# Altium schematic sheet STM32L071CZ.SchDoc
size A3
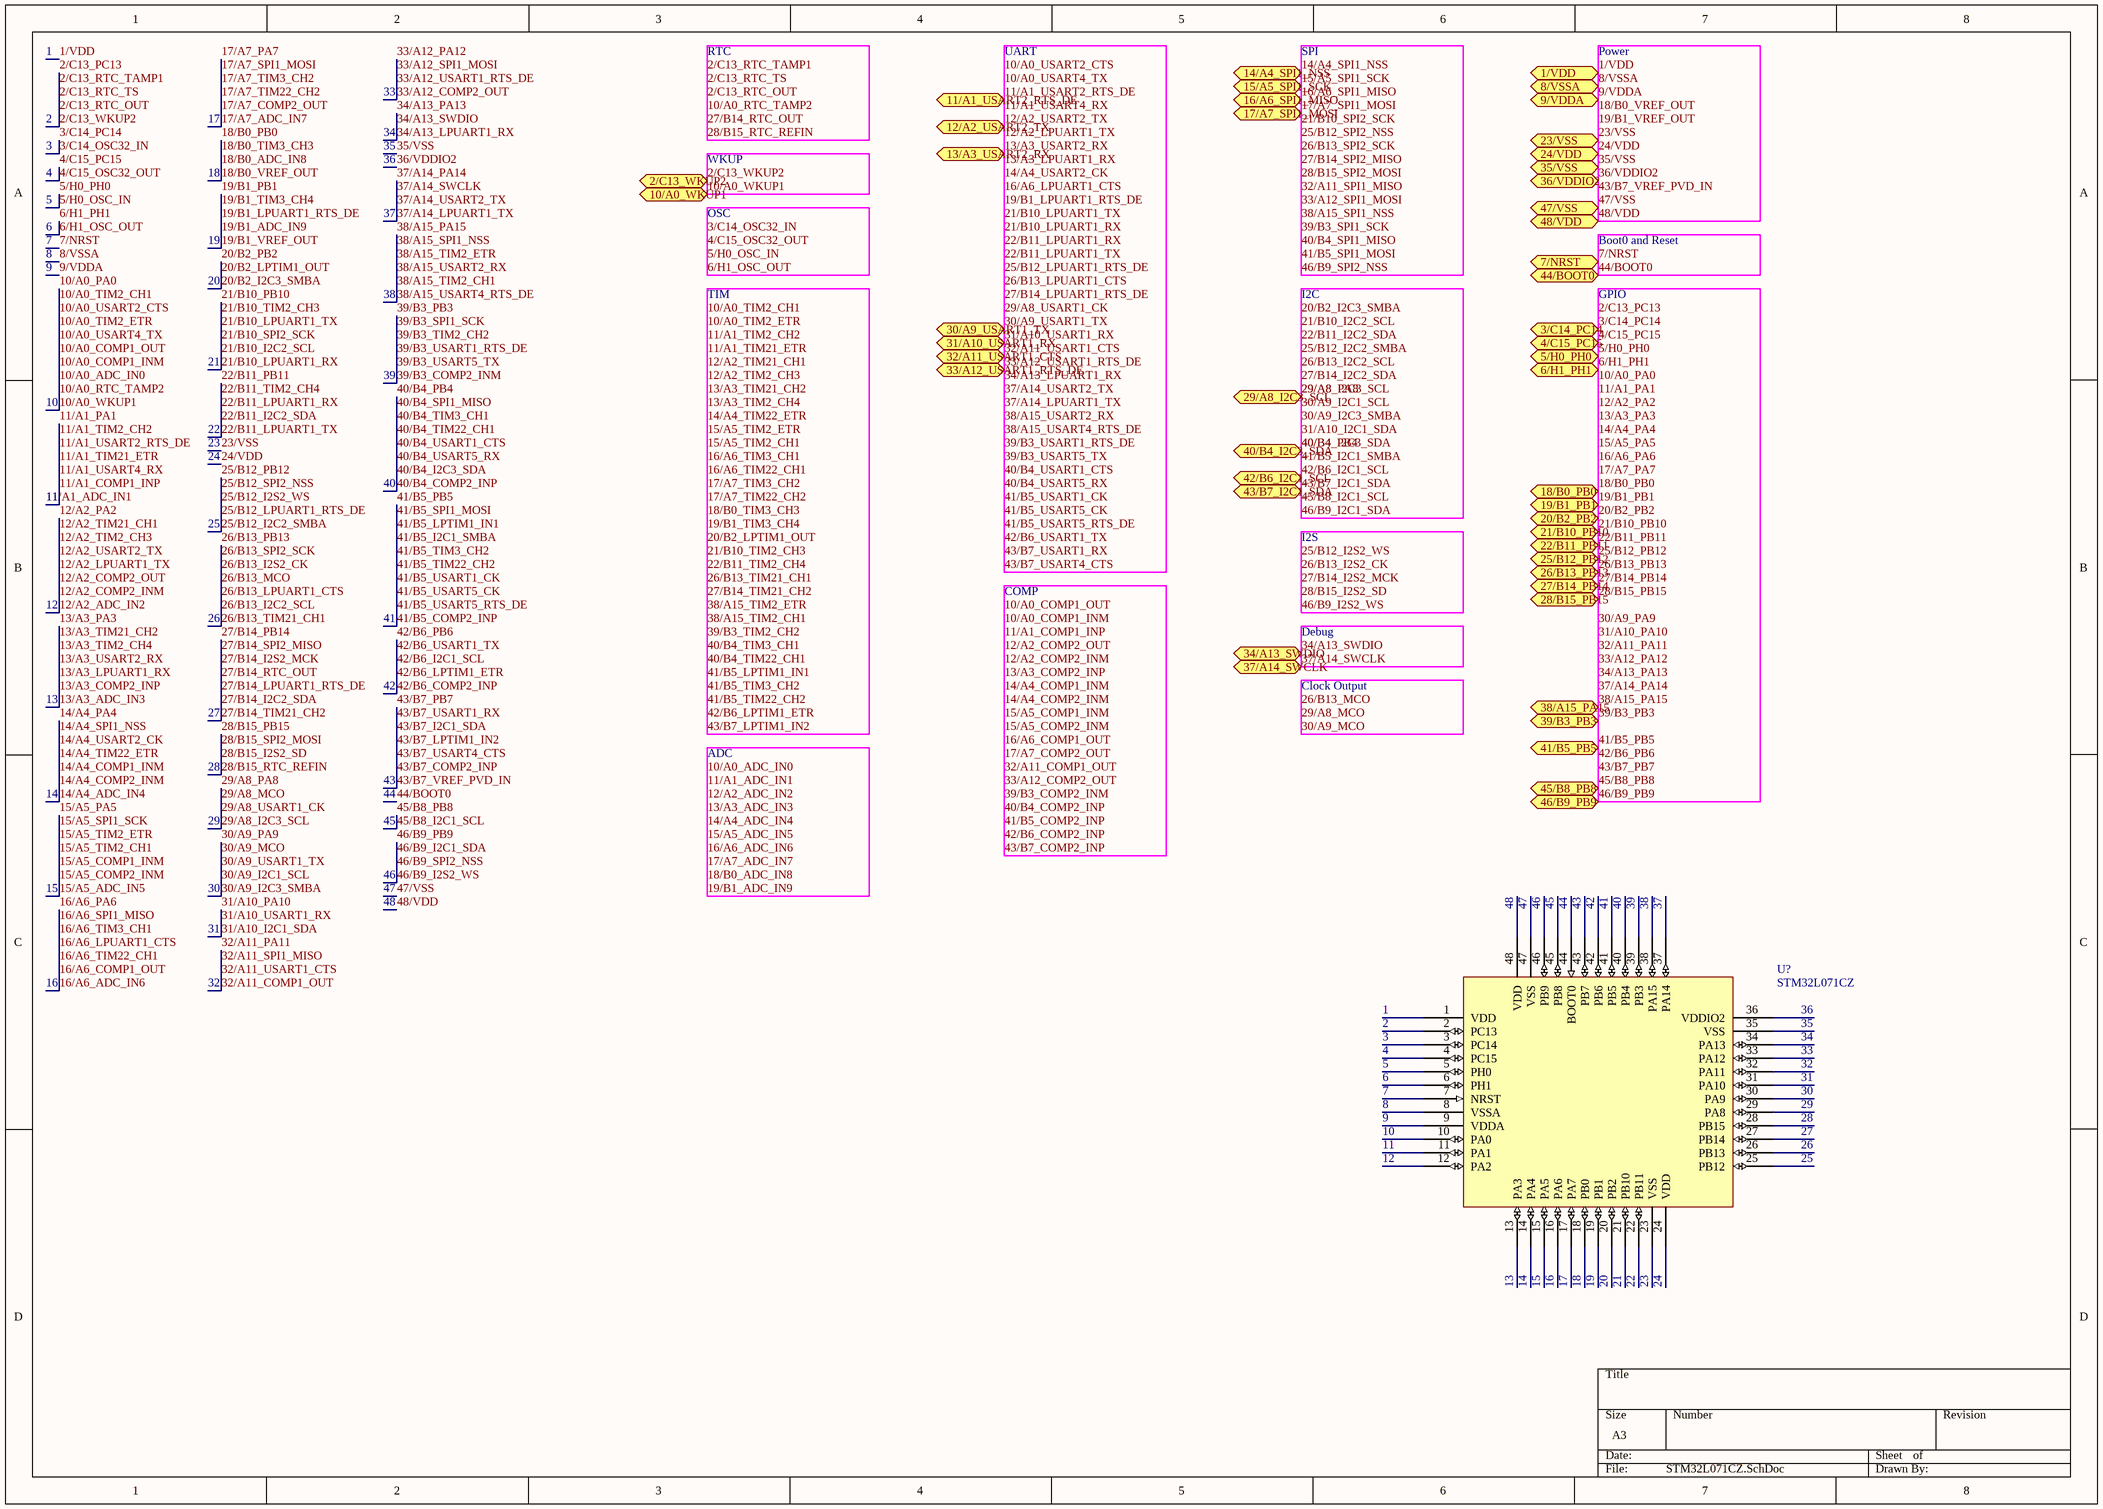
[diagram p0: STM32L071CZ.SchDoc]

## Parts
U?  STM32L071CZ  [LQFP48-7x7]

## Ports
1/VDD, 2/C13_WKUP2, 3/C14_PC14, 4/C15_PC15, 5/H0_PH0, 6/H1_PH1, 7/NRST, 8/VSSA, 9/VDDA, 10/A0_WKUP1, 11/A1_USART2_RTS_DE, 12/A2_USART2_TX, 13/A3_USART2_RX, 14/A4_SPI1_NSS, 15/A5_SPI1_SCK, 16/A6_SPI1_MISO, 17/A7_SPI1_MOSI, 18/B0_PB0, 19/B1_PB1, 20/B2_PB2, 21/B10_PB10, 22/B11_PB11, 23/VSS, 24/VDD, 25/B12_PB12, 26/B13_PB13, 27/B14_PB14, 28/B15_PB15, 29/A8_I2C3_SCL, 30/A9_USART1_TX, 31/A10_USART1_RX, 32/A11_USART1_CTS, 33/A12_USART1_RTS_DE, 34/A13_SWDIO, 35/VSS, 36/VDDIO2, 37/A14_SWCLK, 38/A15_PA15, 39/B3_PB3, 40/B4_I2C3_SDA, 41/B5_PB5, 42/B6_I2C1_SCL, 43/B7_I2C1_SDA, 44/BOOT0, 45/B8_PB8, 46/B9_PB9, 47/VSS, 48/VDD

## Nets
1: U?.1(VDD) ; port 1/VDD  [also labelled 1/VDD]
2: U?.2(PC13) ; port 2/C13_WKUP2  [also labelled 2/C13_PC13, 2/C13_RTC_OUT, 2/C13_RTC_TAMP1, 2/C13_RTC_TS, 2/C13_WKUP2]
3: U?.3(PC14) ; port 3/C14_PC14  [also labelled 3/C14_OSC32_IN, 3/C14_PC14]
4: U?.4(PC15) ; port 4/C15_PC15  [also labelled 4/C15_OSC32_OUT, 4/C15_PC15]
5: U?.5(PH0) ; port 5/H0_PH0  [also labelled 5/H0_OSC_IN, 5/H0_PH0]
6: U?.6(PH1) ; port 6/H1_PH1  [also labelled 6/H1_OSC_OUT, 6/H1_PH1]
7: U?.7(NRST) ; port 7/NRST  [also labelled 7/NRST]
8: U?.8(VSSA) ; port 8/VSSA  [also labelled 8/VSSA]
9: U?.9(VDDA) ; port 9/VDDA  [also labelled 9/VDDA]
10: U?.10(PA0) ; port 10/A0_WKUP1  [also labelled 10/A0_ADC_IN0, 10/A0_COMP1_INM, 10/A0_COMP1_OUT, 10/A0_PA0, 10/A0_RTC_TAMP2, 10/A0_TIM2_CH1, 10/A0_TIM2_ETR, 10/A0_USART2_CTS, 10/A0_USART4_TX, 10/A0_WKUP1]
11: U?.11(PA1) ; port 11/A1_USART2_RTS_DE  [also labelled 11/A1_ADC_IN1, 11/A1_COMP1_INP, 11/A1_PA1, 11/A1_TIM21_ETR, 11/A1_TIM2_CH2, 11/A1_USART2_RTS_DE, 11/A1_USART4_RX]
12: U?.12(PA2) ; port 12/A2_USART2_TX  [also labelled 12/A2_ADC_IN2, 12/A2_COMP2_INM, 12/A2_COMP2_OUT, 12/A2_LPUART1_TX, 12/A2_PA2, 12/A2_TIM21_CH1, 12/A2_TIM2_CH3, 12/A2_USART2_TX]
13: U?.13(PA3) ; port 13/A3_USART2_RX  [also labelled 13/A3_ADC_IN3, 13/A3_COMP2_INP, 13/A3_LPUART1_RX, 13/A3_PA3, 13/A3_TIM21_CH2, 13/A3_TIM2_CH4, 13/A3_USART2_RX]
14: U?.14(PA4) ; port 14/A4_SPI1_NSS  [also labelled 14/A4_ADC_IN4, 14/A4_COMP1_INM, 14/A4_COMP2_INM, 14/A4_PA4, 14/A4_SPI1_NSS, 14/A4_TIM22_ETR, 14/A4_USART2_CK]
15: U?.15(PA5) ; port 15/A5_SPI1_SCK  [also labelled 15/A5_ADC_IN5, 15/A5_COMP1_INM, 15/A5_COMP2_INM, 15/A5_PA5, 15/A5_SPI1_SCK, 15/A5_TIM2_CH1, 15/A5_TIM2_ETR]
16: U?.16(PA6) ; port 16/A6_SPI1_MISO  [also labelled 16/A6_ADC_IN6, 16/A6_COMP1_OUT, 16/A6_LPUART1_CTS, 16/A6_PA6, 16/A6_SPI1_MISO, 16/A6_TIM22_CH1, 16/A6_TIM3_CH1]
17: U?.17(PA7) ; port 17/A7_SPI1_MOSI  [also labelled 17/A7_ADC_IN7, 17/A7_COMP2_OUT, 17/A7_PA7, 17/A7_SPI1_MOSI, 17/A7_TIM22_CH2, 17/A7_TIM3_CH2]
18: U?.18(PB0) ; port 18/B0_PB0  [also labelled 18/B0_ADC_IN8, 18/B0_PB0, 18/B0_TIM3_CH3, 18/B0_VREF_OUT]
19: U?.19(PB1) ; port 19/B1_PB1  [also labelled 19/B1_ADC_IN9, 19/B1_LPUART1_RTS_DE, 19/B1_PB1, 19/B1_TIM3_CH4, 19/B1_VREF_OUT]
20: U?.20(PB2) ; port 20/B2_PB2  [also labelled 20/B2_I2C3_SMBA, 20/B2_LPTIM1_OUT, 20/B2_PB2]
21: U?.21(PB10) ; port 21/B10_PB10  [also labelled 21/B10_I2C2_SCL, 21/B10_LPUART1_RX, 21/B10_LPUART1_TX, 21/B10_PB10, 21/B10_SPI2_SCK, 21/B10_TIM2_CH3]
22: U?.22(PB11) ; port 22/B11_PB11  [also labelled 22/B11_I2C2_SDA, 22/B11_LPUART1_RX, 22/B11_LPUART1_TX, 22/B11_PB11, 22/B11_TIM2_CH4]
23: U?.23(VSS) ; port 23/VSS  [also labelled 23/VSS]
24: U?.24(VDD) ; port 24/VDD  [also labelled 24/VDD]
25: U?.25(PB12) ; port 25/B12_PB12  [also labelled 25/B12_I2C2_SMBA, 25/B12_I2S2_WS, 25/B12_LPUART1_RTS_DE, 25/B12_PB12, 25/B12_SPI2_NSS]
26: U?.26(PB13) ; port 26/B13_PB13  [also labelled 26/B13_I2C2_SCL, 26/B13_I2S2_CK, 26/B13_LPUART1_CTS, 26/B13_MCO, 26/B13_PB13, 26/B13_SPI2_SCK, 26/B13_TIM21_CH1]
27: U?.27(PB14) ; port 27/B14_PB14  [also labelled 27/B14_I2C2_SDA, 27/B14_I2S2_MCK, 27/B14_LPUART1_RTS_DE, 27/B14_PB14, 27/B14_RTC_OUT, 27/B14_SPI2_MISO, 27/B14_TIM21_CH2]
28: U?.28(PB15) ; port 28/B15_PB15  [also labelled 28/B15_I2S2_SD, 28/B15_PB15, 28/B15_RTC_REFIN, 28/B15_SPI2_MOSI]
29: U?.29(PA8) ; port 29/A8_I2C3_SCL  [also labelled 29/A8_I2C3_SCL, 29/A8_MCO, 29/A8_PA8, 29/A8_USART1_CK]
30: U?.30(PA9) ; port 30/A9_USART1_TX  [also labelled 30/A9_I2C1_SCL, 30/A9_I2C3_SMBA, 30/A9_MCO, 30/A9_PA9, 30/A9_USART1_TX]
31: U?.31(PA10) ; port 31/A10_USART1_RX  [also labelled 31/A10_I2C1_SDA, 31/A10_PA10, 31/A10_USART1_RX]
32: U?.32(PA11) ; port 32/A11_USART1_CTS  [also labelled 32/A11_COMP1_OUT, 32/A11_PA11, 32/A11_SPI1_MISO, 32/A11_USART1_CTS]
33: U?.33(PA12) ; port 33/A12_USART1_RTS_DE  [also labelled 33/A12_COMP2_OUT, 33/A12_PA12, 33/A12_SPI1_MOSI, 33/A12_USART1_RTS_DE]
34: U?.34(PA13) ; port 34/A13_SWDIO  [also labelled 34/A13_LPUART1_RX, 34/A13_PA13, 34/A13_SWDIO]
35: U?.35(VSS) ; port 35/VSS  [also labelled 35/VSS]
36: U?.36(VDDIO2) ; port 36/VDDIO2  [also labelled 36/VDDIO2]
37: U?.37(PA14) ; port 37/A14_SWCLK  [also labelled 37/A14_LPUART1_TX, 37/A14_PA14, 37/A14_SWCLK, 37/A14_USART2_TX]
38: U?.38(PA15) ; port 38/A15_PA15  [also labelled 38/A15_PA15, 38/A15_SPI1_NSS, 38/A15_TIM2_CH1, 38/A15_TIM2_ETR, 38/A15_USART2_RX, 38/A15_USART4_RTS_DE]
39: U?.39(PB3) ; port 39/B3_PB3  [also labelled 39/B3_COMP2_INM, 39/B3_PB3, 39/B3_SPI1_SCK, 39/B3_TIM2_CH2, 39/B3_USART1_RTS_DE, 39/B3_USART5_TX]
40: U?.40(PB4) ; port 40/B4_I2C3_SDA  [also labelled 40/B4_COMP2_INP, 40/B4_I2C3_SDA, 40/B4_PB4, 40/B4_SPI1_MISO, 40/B4_TIM22_CH1, 40/B4_TIM3_CH1, 40/B4_USART1_CTS, 40/B4_USART5_RX]
41: U?.41(PB5) ; port 41/B5_PB5  [also labelled 41/B5_COMP2_INP, 41/B5_I2C1_SMBA, 41/B5_LPTIM1_IN1, 41/B5_PB5, 41/B5_SPI1_MOSI, 41/B5_TIM22_CH2, 41/B5_TIM3_CH2, 41/B5_USART1_CK, 41/B5_USART5_CK, 41/B5_USART5_RTS_DE]
42: U?.42(PB6) ; port 42/B6_I2C1_SCL  [also labelled 42/B6_COMP2_INP, 42/B6_I2C1_SCL, 42/B6_LPTIM1_ETR, 42/B6_PB6, 42/B6_USART1_TX]
43: U?.43(PB7) ; port 43/B7_I2C1_SDA  [also labelled 43/B7_COMP2_INP, 43/B7_I2C1_SDA, 43/B7_LPTIM1_IN2, 43/B7_PB7, 43/B7_USART1_RX, 43/B7_USART4_CTS, 43/B7_VREF_PVD_IN]
44: U?.44(BOOT0) ; port 44/BOOT0  [also labelled 44/BOOT0]
45: U?.45(PB8) ; port 45/B8_PB8  [also labelled 45/B8_I2C1_SCL, 45/B8_PB8]
46: U?.46(PB9) ; port 46/B9_PB9  [also labelled 46/B9_I2C1_SDA, 46/B9_I2S2_WS, 46/B9_PB9, 46/B9_SPI2_NSS]
47: U?.47(VSS) ; port 47/VSS  [also labelled 47/VSS]
48: U?.48(VDD) ; port 48/VDD  [also labelled 48/VDD]

## Notes on the sheet
- RTC
- UART
- SPI
- Power
- WKUP
- OSC
- Boot0 and Reset
- TIM
- I2C
- GPIO
- I2S
- COMP
- Debug
- Clock Output
- ADC
- Labels drawn without touching a wire or pin: 2/C13_PC13, 2/C13_RTC_OUT, 2/C13_RTC_TAMP1, 2/C13_RTC_TS, 3/C14_OSC32_IN, 4/C15_OSC32_OUT, 5/H0_OSC_IN, 6/H1_OSC_OUT, 10/A0_ADC_IN0, 10/A0_COMP1_INM, 10/A0_COMP1_OUT, 10/A0_PA0, 10/A0_RTC_TAMP2, 10/A0_TIM2_CH1, 10/A0_TIM2_ETR, 10/A0_USART2_CTS, 10/A0_USART4_TX, 11/A1_ADC_IN1, 11/A1_COMP1_INP, 11/A1_PA1, 11/A1_TIM2_CH2, 11/A1_TIM21_ETR, 11/A1_USART4_RX, 12/A2_ADC_IN2, 12/A2_COMP2_INM, 12/A2_COMP2_OUT, 12/A2_LPUART1_TX, 12/A2_PA2, 12/A2_TIM2_CH3, 12/A2_TIM21_CH1, 13/A3_ADC_IN3, 13/A3_COMP2_INP, 13/A3_LPUART1_RX, 13/A3_PA3, 13/A3_TIM2_CH4, 13/A3_TIM21_CH2, 14/A4_ADC_IN4, 14/A4_COMP1_INM, 14/A4_COMP2_INM, 14/A4_PA4, 14/A4_TIM22_ETR, 14/A4_USART2_CK, 15/A5_ADC_IN5, 15/A5_COMP1_INM, 15/A5_COMP2_INM, 15/A5_PA5, 15/A5_TIM2_CH1, 15/A5_TIM2_ETR, 16/A6_ADC_IN6, 16/A6_COMP1_OUT, 16/A6_LPUART1_CTS, 16/A6_PA6, 16/A6_TIM3_CH1, 16/A6_TIM22_CH1, 17/A7_ADC_IN7, 17/A7_COMP2_OUT, 17/A7_PA7, 17/A7_TIM3_CH2, 17/A7_TIM22_CH2, 18/B0_ADC_IN8, 18/B0_TIM3_CH3, 18/B0_VREF_OUT, 19/B1_ADC_IN9, 19/B1_LPUART1_RTS_DE, 19/B1_TIM3_CH4, 19/B1_VREF_OUT, 20/B2_I2C3_SMBA, 20/B2_LPTIM1_OUT, 21/B10_I2C2_SCL, 21/B10_LPUART1_RX, 21/B10_LPUART1_TX, 21/B10_SPI2_SCK, 21/B10_TIM2_CH3, 22/B11_I2C2_SDA, 22/B11_LPUART1_RX, 22/B11_LPUART1_TX, 22/B11_TIM2_CH4, 25/B12_I2C2_SMBA, 25/B12_I2S2_WS, 25/B12_LPUART1_RTS_DE, 25/B12_SPI2_NSS, 26/B13_I2C2_SCL, 26/B13_I2S2_CK, 26/B13_LPUART1_CTS, 26/B13_MCO, 26/B13_SPI2_SCK, 26/B13_TIM21_CH1, 27/B14_I2C2_SDA, 27/B14_I2S2_MCK, 27/B14_LPUART1_RTS_DE, 27/B14_RTC_OUT, 27/B14_SPI2_MISO, 27/B14_TIM21_CH2, 28/B15_I2S2_SD, 28/B15_RTC_REFIN, 28/B15_SPI2_MOSI, 29/A8_MCO, 29/A8_USART1_CK, 30/A9_I2C1_SCL, 30/A9_I2C3_SMBA, 30/A9_MCO, 30/A9_PA9, 31/A10_I2C1_SDA, 31/A10_PA10, 32/A11_COMP1_OUT, 32/A11_PA11, 32/A11_SPI1_MISO, 33/A12_COMP2_OUT, 33/A12_PA12, 33/A12_SPI1_MOSI, 34/A13_LPUART1_RX, 34/A13_PA13, 37/A14_LPUART1_TX, 37/A14_PA14, 37/A14_USART2_TX, 38/A15_SPI1_NSS, 38/A15_TIM2_CH1, 38/A15_TIM2_ETR, 38/A15_USART2_RX, 38/A15_USART4_RTS_DE, 39/B3_COMP2_INM, 39/B3_SPI1_SCK, 39/B3_TIM2_CH2, 39/B3_USART1_RTS_DE, 39/B3_USART5_TX, 40/B4_COMP2_INP, 40/B4_SPI1_MISO, 40/B4_TIM3_CH1, 40/B4_TIM22_CH1, 40/B4_USART1_CTS, 40/B4_USART5_RX, 41/B5_COMP2_INP, 41/B5_I2C1_SMBA, 41/B5_LPTIM1_IN1, 41/B5_SPI1_MOSI, 41/B5_TIM3_CH2, 41/B5_TIM22_CH2, 41/B5_USART1_CK, 41/B5_USART5_CK, 41/B5_USART5_RTS_DE, 42/B6_COMP2_INP, 42/B6_LPTIM1_ETR, 42/B6_PB6, 42/B6_USART1_TX, 43/B7_COMP2_INP, 43/B7_LPTIM1_IN2, 43/B7_PB7, 43/B7_USART1_RX, 43/B7_USART4_CTS, 43/B7_VREF_PVD_IN, 45/B8_I2C1_SCL, 46/B9_I2C1_SDA, 46/B9_I2S2_WS, 46/B9_SPI2_NSS

## Library data of the parts
U? = STM32L071CZ: Cortex M0+ Low Power; Designator: U?; Code: ISR02010258; Bus width: 32; Voltage: 1V65-3V6; Voltage max: 4; FLASH: 192k; SRAM: 20k; Part Number: STM32L071CZ; Part Type: MCU; Value: STM32L071CZ; Library path: SIMBOLS_CPU_MCU.SCHLIB; Footprint path: FootprintsPersonals.PcbLib